# EAGLE design Keyboard (EAGLE 8.3.0)
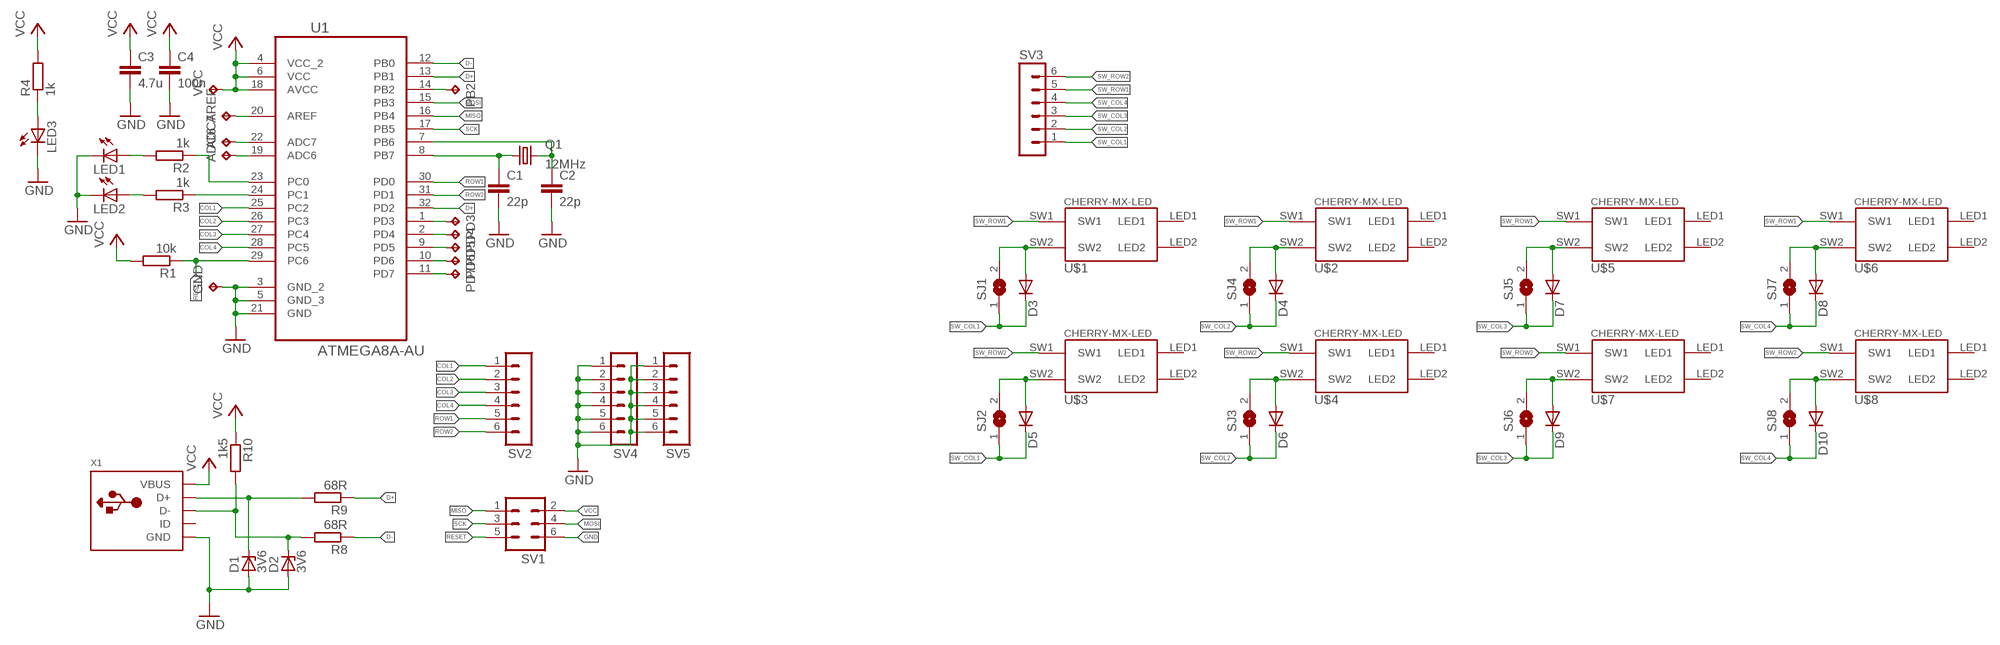
[diagram p0: schematic, sheet 1]

## Parts
ADC6  TPB1,27  [B1,27]
ADC7  TPB1,27  [B1,27]
AREF  TPB1,27  [B1,27]
C1  22p  C-EUC0603  [C0603]
C2  22p  C-EUC0603  [C0603]
C3  4.7u  C-EUC0603  [C0603]
C4  100n  C-EUC0603  [C0603]
D1  3V6  ZENER-DIODESOD80C  [SOD80C]
D2  3V6  ZENER-DIODESOD80C  [SOD80C]
D3  DIODE-MINIMELF  [MINIMELF]
D4  DIODE-MINIMELF  [MINIMELF]
D5  DIODE-MINIMELF  [MINIMELF]
D6  DIODE-MINIMELF  [MINIMELF]
D7  DIODE-MINIMELF  [MINIMELF]
D8  DIODE-MINIMELF  [MINIMELF]
D9  DIODE-MINIMELF  [MINIMELF]
D10  DIODE-MINIMELF  [MINIMELF]
GND  TPB1,27  [B1,27]
LED1  LEDCHIP-LED0603  [CHIP-LED0603]
LED2  LEDCHIP-LED0603  [CHIP-LED0603]
LED3  LEDCHIP-LED0603  [CHIP-LED0603]
PB2  TPB1,27  [B1,27]
PD3  TPB1,27  [B1,27]
PD4  TPB1,27  [B1,27]
PD5  TPB1,27  [B1,27]
PD6  TPB1,27  [B1,27]
PD7  TPB1,27  [B1,27]
Q1  12MHz  KX-K  [11.4X4.5]
R1  10k  R-EU_R0603  [R0603]
R2  1k  R-EU_R0603  [R0603]
R3  1k  R-EU_R0603  [R0603]
R4  1k  R-EU_R0603  [R0603]
R8  68R  R-EU_R0603  [R0603]
R9  68R  R-EU_R0603  [R0603]
R10  1k5  R-EU_R0603  [R0603]
SJ1  SJCLOSED  [SJC]
SJ2  SJCLOSED  [SJC]
SJ3  SJCLOSED  [SJC]
SJ4  SJCLOSED  [SJC]
SJ5  SJCLOSED  [SJC]
SJ6  SJCLOSED  [SJC]
SJ7  SJCLOSED  [SJC]
SJ8  SJCLOSED  [SJC]
SV1  MA03-2  [MA03-2]
SV2  MA06-1  [MA06-1]
SV3  MA06-1  [MA06-1]
SV4  MA06-1  [MA06-1]
SV5  MA06-1  [MA06-1]
U1  ATMEGA8A-AU  [QFP80P900X900X120-32N]
U$1  CHERRY-MX-LED  [CHERRY-MX-LED]
U$2  CHERRY-MX-LED  [CHERRY-MX-LED]
U$3  CHERRY-MX-LED  [CHERRY-MX-LED]
U$4  CHERRY-MX-LED  [CHERRY-MX-LED]
U$5  CHERRY-MX-LED  [CHERRY-MX-LED]
U$6  CHERRY-MX-LED  [CHERRY-MX-LED]
U$7  CHERRY-MX-LED  [CHERRY-MX-LED]
U$8  CHERRY-MX-LED  [CHERRY-MX-LED]
VCC  TPB1,27  [B1,27]
X1  USB_MICRO_20329_V2  [4UCONN_20329_V2]

## Nets
COL1: SV2.1 U1.25(PC2)
COL2: SV2.2 U1.26(PC3)
COL3: SV2.3 U1.27(PC4)
COL4: SV2.4 U1.28(PC5)
D+: R9.1 U1.13(PB1) U1.32(PD2)
D-: R8.1 U1.12(PB0)
GND: C1.2 C2.2 C3.2 C4.2 D1.A D2.A GND.TP LED1.C LED2.C LED3.C SV1.6 SV4.1 SV4.2 SV4.3 SV4.4 SV4.5 SV4.6 SV5.1 SV5.2 SV5.3 SV5.4 SV5.5 SV5.6 U1.3(GND_2) U1.5(GND_3) U1.21(GND) X1.BASE@1(GND) X1.BASE@2(GND) X1.GND X1.SPRT@1(GND) X1.SPRT@2(GND) X1.SPRT@3(GND) X1.SPRT@4(GND)
MISO: SV1.1 U1.16(PB4)
MOSI: SV1.4 U1.15(PB3)
N$1: C1.1 Q1.1 U1.8(PB7)
N$2: C2.1 Q1.2 U1.7(PB6)
N$3: LED3.A R4.1
N$4: R3.1 U1.24(PC1)
N$5: R2.1 U1.23(PC0)
N$6: LED1.A R2.2
N$7: LED2.A R3.2
N$9: D1.C R9.2 X1.D+
N$10: D2.C R8.2 R10.2 X1.D-
N$14: PD7.TP U1.11(PD7)
N$15: D3.A SJ1.2 U$1.SW2
N$16: D5.A SJ2.2 U$3.SW2
N$17: PD6.TP U1.10(PD6)
N$18: D4.A SJ4.2 U$2.SW2
N$19: PD5.TP U1.9(PD5)
N$20: D6.A SJ3.2 U$4.SW2
N$21: PD4.TP U1.2(PD4)
N$22: D7.A SJ5.2 U$5.SW2
N$23: PD3.TP U1.1(PD3)
N$24: D9.A SJ6.2 U$7.SW2
N$25: AREF.TP U1.20(AREF)
N$26: D8.A SJ7.2 U$6.SW2
N$27: ADC7.TP U1.22(ADC7)
N$28: D10.A SJ8.2 U$8.SW2
N$29: ADC6.TP U1.19(ADC6)
N$30: PB2.TP U1.14(PB2)
RESET: R1.1 SV1.5 U1.29(PC6)
ROW1: SV2.5 U1.30(PD0)
ROW2: SV2.6 U1.31(PD1)
SCK: SV1.3 U1.17(PB5)
SW_COL1: D3.C D5.C SJ1.1 SJ2.1 SV3.1
SW_COL2: D4.C D6.C SJ3.1 SJ4.1 SV3.2
SW_COL3: D7.C D9.C SJ5.1 SJ6.1 SV3.3
SW_COL4: D8.C D10.C SJ7.1 SJ8.1 SV3.4
SW_ROW1: SV3.5 U$1.SW1 U$2.SW1 U$5.SW1 U$6.SW1
SW_ROW2: SV3.6 U$3.SW1 U$4.SW1 U$7.SW1 U$8.SW1
VCC: C3.1 C4.1 R1.2 R4.2 R10.1 SV1.2 U1.4(VCC_2) U1.6(VCC) U1.18(AVCC) VCC.TP X1.VBUS
Unconnected: U$1.LED1 U$1.LED2 U$2.LED1 U$2.LED2 U$3.LED1 U$3.LED2 U$4.LED1 U$4.LED2 U$5.LED1 U$5.LED2 U$6.LED1 U$6.LED2 U$7.LED1 U$7.LED2 U$8.LED1 U$8.LED2 X1.ID

## Library data of the parts
ADC6 ADC7 AREF GND PB2 PD3-PD7 VCC = testpad:TP: Test pad
C1-C4 = resistor:C-EU: CAPACITOR, European symbol
D1 D2 = diode:ZENER-DIODE: Z-Diode
D3-D10 = diode:DIODE-: DIODE
LED1-LED3 = led:LED: LED OSRAM: - CHIPLED LG R971, LG N971, LY N971, LG Q971, LY Q971, LO R971, LY R971 LH N974, LH R974 LS Q976, LO Q976, LY Q976 LO Q996 - Hyper CHIPLED LW Q18S LB Q993, LB Q99A, LB R99A - SideLED LS A670, LO A670, LY A670, LG A670, LP A670 LB A673, LV A673, LT A673, LW A673 LH A674 LY A675 LS A676, LA A676, LO A676, LY A676, LW A676 LS A679, LY A679, LG A679 - Hyper Micro SIDELED® LS Y876, LA Y876, LO Y876, LY Y876 LT Y87S - SmartLED LW L88C, LW L88S LB L89C, LB L89S, LG L890 LS L89K, LO L89K, LY L89K LS L896, LA L896, LO L896, LY L896 - TOPLED LS T670, LO T670, LY T670, LG T670, LP T670 LSG T670, LSP T670, LSY T670, LOP T670, LYG T670 LG T671, LOG T671, LSG T671 LB T673, LV T673, LT T673, LW T673 LH T674 LS T676, LA T676, LO T676, LY T676, LB T676, LH T676, LSB T676, LW T676 LB T67C, LV T67C, LT T67C, LS T67K, LO T67K, LY T67K, LW E67C LS E67B, LA E67B, LO E67B, LY E67B, LB E67C, LV E67C, LT E67C LW T67C LS T679, LY T679, LG T679 LS T770, LO T770, LY T770, LG T770, LP T770 LB T773, LV T773, LT T773, LW T773 LH T774 LS E675, LA E675, LY E675, LS T675 LS T776, LA T776, LO T776, LY T776, LB T776 LHGB T686 LT T68C, LB T68C - Hyper Mini TOPLED® LB M676 - Mini TOPLED Santana® LG M470 LS M47K, LO M47K, LY M47K Source: http://www.osram.convergy.de LUXEON: - LUMILED® LXK2-PW12-R00, LXK2-PW12-S00, LXK2-PW14-U00, LXK2-PW14-V00 LXK2-PM12-R00, LXK2-PM12-S00, LXK2-PM14-U00 LXK2-PE12-Q00, LXK2-PE12-R00, LXK2-PE12-S00, LXK2-PE14-T00, LXK2-PE14-U00 LXK2-PB12-K00, LXK2-PB12-L00, LXK2-PB12-M00, LXK2-PB14-N00, LXK2-PB14-P00, LXK2-PB14-Q00 LXK2-PR12-L00, LXK2-PR12-M00, LXK2-PR14-Q00, LXK2-PR14-R00 LXK2-PD12-Q00, LXK2-PD12-R00, LXK2-PD12-S00 LXK2-PH12-R00, LXK2-PH12-S00 LXK2-PL12-P00, LXK2-PL12-Q00, LXK2-PL12-R00 Source: www.luxeon.com KINGBRIGHT: KA-3528ASYC Source: www.kingbright.com
Q1 = crystal-geyer_V1_0:KX: Quartz Crystals (MHz) SMD: KX - Serie Model Size l/w/h [mm] Frequency Range Frequency Stability Temp. Range [°C] Load Capacitance AECQ 200 availabel Datasheet KX-4 KX-5 KX-6 KX-7 KX-9A KX-9B KX-12A KX-12B KX-13 KX-20 KX-K KX-KS 1.6/1.2/0.3 2.0/1.6/0.45 2.5/2.0/0.55 3.2/2.5/0.8 5.0/3.2/1.0 5.0/3.2/1.1 6.0/3.5/1.1 6.0/3.5/1.0 7.0/5.0 /1.3 11.6/5.5/1.6 12.3/4.5/4.2 12.3/4.5/3.2 24.0 ~ 80.0 MHz 16.0 ~ 80.0 MHz 12.0 ~ 80.0 MHz 8.0 ~ 60.0 MHz 7,68 ~ 300,0 MHz 8,0 ~ 50,0 MHz 8,0 ~ 150,0 MHz 8,0 ~ 50,0 MHz 6,0 ~ 160,0 MHz 3,579 ~ 25,0 MHz 3,579 ~ 70,0 MHz 3,579 ~ 70,0 MHz ±10 … ±50ppm ±10 … ±50ppm ±10 … ±50ppm ±10 … ±50ppm ±10 … ±50ppm ±10 … ±50ppm ±10 … ±50ppm ±10 … ±50ppm ±10 … ±50ppm ±50ppm ±10 … ±50ppm ±10 … ±50ppm (*) -40°C …+85°C (*) -40°C …+125°C (*) -40°C …+125°C (*) -40°C …+125°C (*) -40°C …+105°C (*) -40°C …+105°C (*) -40°C …+125°C (*) -40°C …+105°C (*) -40°C …+105°C (*) -40°C …+105°C (*) -40°C …+85°C (*) -40°C …+85°C 8, 8…16 8, 8…16 10, 8…16 12, 7…20 16, 10…20 16, 10…20 16, 10…20 16, 12…20 16, 12…20 16, 12…20 16, 12…30 16, 12…30 - yes yes yes - - - - - - - - KX-4.pdf <http://www.geyer-electronic.de/uploads/tx_userartikelfrequenz/GEYER-KX-4.pdf> KX-5.pdf <http://www.geyer-electronic.de/uploads/tx_userartikelfrequenz/GEYER-KX-5.pdf> KX-6.pdf <http://www.geyer-electronic.de/uploads/tx_userartikelfrequenz/GEYER-KX-6.pdf> KX-7.pdf <http://www.geyer-electronic.de/uploads/tx_userartikelfrequenz/GEYER-KX-7.pdf> KX-9A.pdf <http://www.geyer-electronic.de/uploads/tx_userartikelfrequenz/GEYER-KX-9A.pdf> KX-9B.pdf <http://www.geyer-electronic.de/uploads/tx_userartikelfrequenz/GEYER-KX-9B.pdf> KX-12A.pdf <http://www.geyer-electronic.de/uploads/tx_userartikelfrequenz/GEYER-KX-12A.pdf> KX-12B.pdf <http://www.geyer-electronic.de/uploads/tx_userartikelfrequenz/GEYER-KX-12B.pdf> KX-13.pdf <http://www.geyer-electronic.de/uploads/tx_userartikelfrequenz/GEYER-KX-13.pdf> KX-20.pdf <http://www.geyer-electronic.de/uploads/tx_userartikelfrequenz/GEYER-KX-20.pdf> KX-K.pdf <http://www.geyer-electronic.de/uploads/tx_userartikelfrequenz/GEYER-KX-K.pdf> KX-KS.pdf <http://www.geyer-electronic.de/uploads/tx_userartikelfrequenz/GEYER-KX-KS.pdf> <http://www.geyer-electronic.de/fileadmin/template/img/logo-geyer-electronic.png> Details see: http://www.geyer-electronic.de/Frequenz-Produkte.9.0.html Created 2016-06-07, Hans Locher 2016 (C) Geyer Quartz Technology KX4,KX5,KX6,KX7,KX9A,KX9B,KX12A,KX12B,KX13,KX20,KXK,KXKS;1612;2016;2520;3225;5032;6035;7050;11655;12345;1,6x1,2;2,0x1,6;2,5x2,0;3,2x2,5;5,0x3,2;6,0x3,5;7,0x5,0;11,6x5,5;12,3x4,5;12,3x4,5;1.6x1.2;2.0x1.6;2.5x2.0;3.2x2.5;5.0x3.2;6.0x3.5;7.0x5.0;11.6x5.5;12.3x4.5;12.3x4.5;
R1-R4 R8-R10 = resistor:R-EU_: RESISTOR, European symbol
SJ1-SJ8 = jumper:SJ: SMD solder JUMPER
SV1 = con-lstb:MA03-2: PIN HEADER; OC_FARNELL: unknown; OC_NEWARK: unknown
SV2-SV5 = con-lstb:MA06-1: PIN HEADER; OC_FARNELL: unknown; OC_NEWARK: unknown
U1 = Atmel_By_element14_Batch_1-00:ATMEGA8A-AU: Programmable Flash; MPN: ATMEGA8A-AU; OC_FARNELL: 1748532; OC_NEWARK: 26R5638; PACKAGE: TQFP-32; SUPPLIER: Atmel
U$1-U$8 = cherrymx:CHERRY-MX-LED: Cherry MX series keyswitch with LED
X1 = microbuilder:USB: USB Connectors USBMINIB - Surface Mount Female Mini-B USB Connector 4UConnector: 06564

## Board
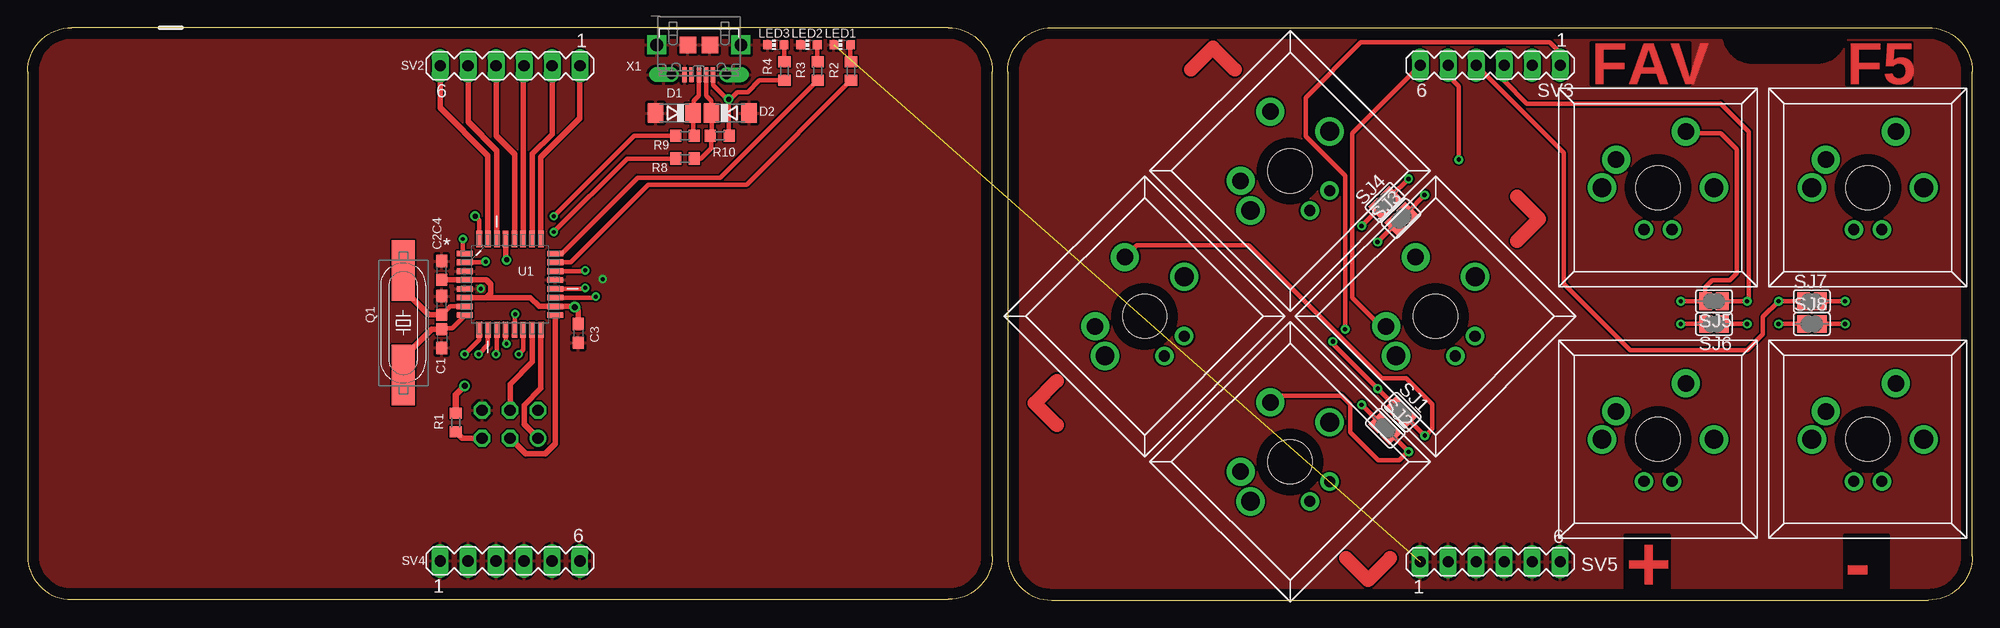
[diagram p1: board, top side]
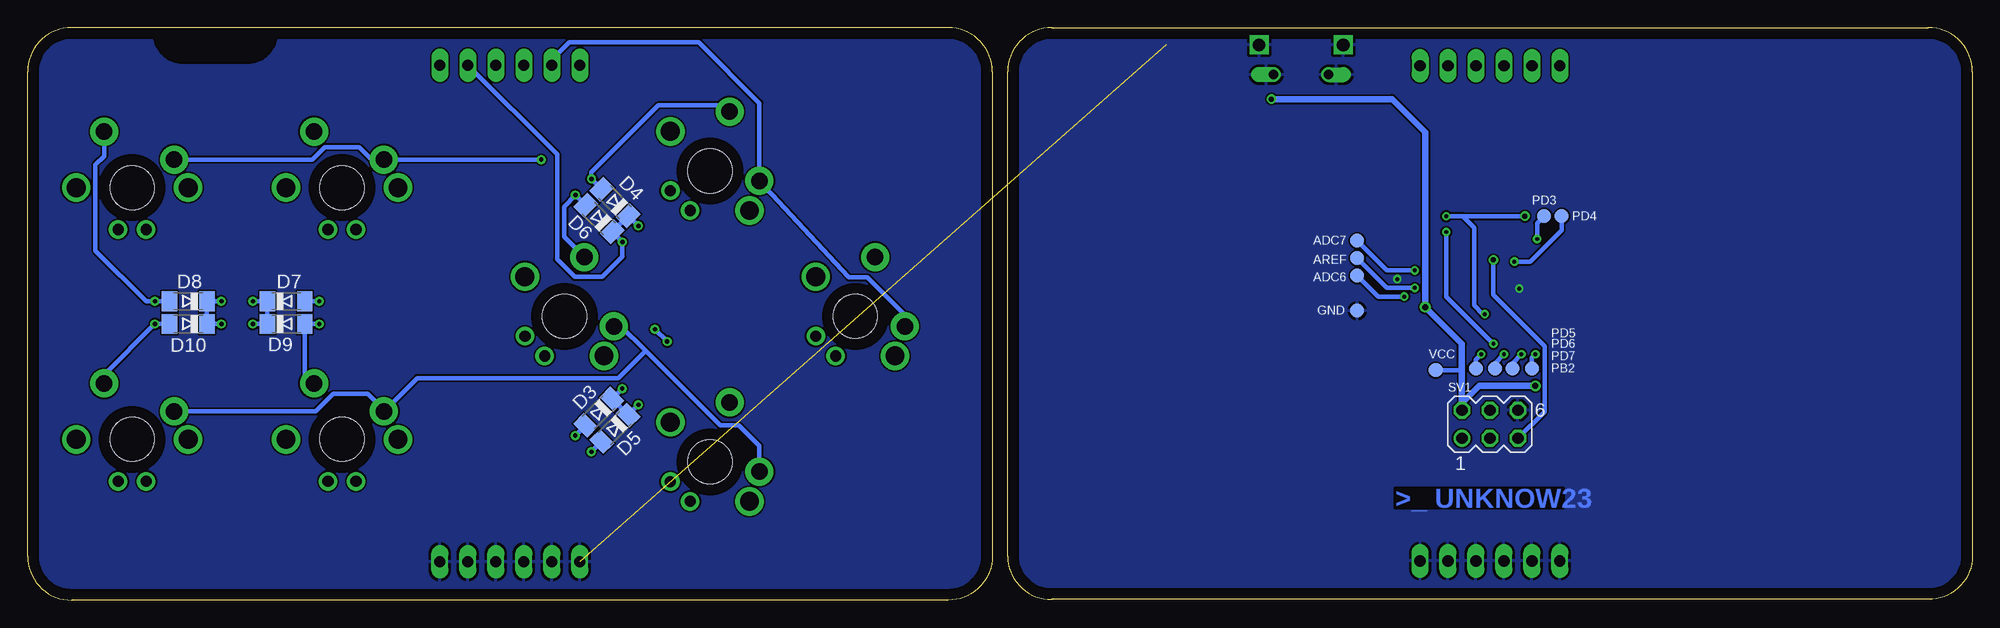
[diagram p2: board, bottom side, seen from below]

Size 176.61 x 52 mm. Coordinates in mm from the lower left corner, seen from the top.
Outline: 93,0 172.61,0 arc90 176.61,4 176.61,48 arc90 172.61,52 93,52 arc90 89,48 89,4 arc90 93,0
Outline: 87.61,4 87.61,48 arc90 83.61,52 4,52 arc90 0,48 0,4 arc90 4,0.07 83.61,0.07 arc90 87.61,4
Copper layers (1*16): Top 0.035mm / dielectric 1.5mm / Bottom 0.035mm
Design rules "default *": minimum track width 6mil, minimum drill 0.35mm, track to track 6mil, track to pad 6mil, pad to pad 6mil, via to via 6mil, smd to smd 6mil, copper to edge 40mil, drill to drill 6mil, minimum pad ring 10mil, minimum via ring 8mil, stop-mask expansion 4mil, vias tented up to drill 0mil, thermal gap 10mil
tRestrict: area 154.1,48.9 to 165,51.9
bRestrict: area 154.1,48.9 to 165,51.9

### Footprints (pad centres in the part's own frame; a part is rotated, then mirrored left to right if it is on the bottom)
B1,27 = smd 1.27 x 1.27: TP 0,0
C0603 = smd 1.1 x 1: 1 -0.85,0; 2 0.85,0
SOD80C = smd 1.4 x 1.8: A 1.7,0; C -1.7,0
MINIMELF = smd 1.4 x 1.8: A 1.7,0; C -1.7,0
CHIP-LED0603 = smd 0.8 x 0.8: A 0,-0.75; C 0,0.75
11.4X4.5 = smd 5.5 x 2.08: 1 -4.75,0; 2 4.75,0
R0603 = smd 1 x 1.1: 1 -0.85,0; 2 0.85,0
SJC = smd 1.168 x 1.6: 1 -0.762,0; 2 0.762,0
MA03-2 = drill 1.016: 1 -2.54,-1.27 | drill 1.016 octagon: 2 -2.54,1.27; 3 0,-1.27; 4 0,1.27; 5 2.54,-1.27; 6 2.54,1.27
MA06-1 = drill 1.016 long: 1 -6.35,0; 2 -3.81,0; 3 -1.27,0; 4 1.27,0; 5 3.81,0; 6 6.35,0
QFP80P900X900X120-32N = smd 1.473 x 0.508: 1 -4.115,2.794; 2 -4.115,2.007; 3 -4.115,1.194; 4 -4.115,0.406; 5 -4.115,-0.406; 6 -4.115,-1.194; 7 -4.115,-2.007; 8 -4.115,-2.794; 17 4.115,-2.794; 18 4.115,-2.007; 19 4.115,-1.194; 20 4.115,-0.406; 21 4.115,0.406; 22 4.115,1.194; 23 4.115,2.007; 24 4.115,2.794 | smd 0.508 x 1.473: 9 -2.794,-4.115; 10 -2.007,-4.115; 11 -1.194,-4.115; 12 -0.406,-4.115; 13 0.406,-4.115; 14 1.194,-4.115; 15 2.007,-4.115; 16 2.794,-4.115; 25 2.794,4.115; 26 2.007,4.115; 27 1.194,4.115; 28 0.406,4.115; 29 -0.406,4.115; 30 -1.194,4.115; 31 -2.007,4.115; 32 -2.794,4.115
CHERRY-MX-LED = drill 1.016 pad 1.676: LED1 -1.27,-3.81; LED2 1.27,-3.81 | drill 1.714 pad 1.93: P$3 -5.08,0; P$4 5.08,0 | drill 1.5 pad 2.54: SW1 -3.81,2.54; SW2 2.54,5.08 | hole 4: 0,0
4UCONN_20329_V2 = smd 1.5 x 1.5: BASE@1 -1,0; BASE@2 1,0 | smd 0.4 x 1.35: D+ 0,2.7; D- -0.65,2.7; GND 1.3,2.7; ID 0.65,2.7; VBUS -1.3,2.7 | drill 0.85 pad 1.2 offset: SPRT@1 -2.5,2.7; SPRT@2 2.5,2.7 | drill 1.15 pad 1.55 square: SPRT@3 -3.825,0; SPRT@4 3.825,0

### Placement (x,y rotation side)
ADC6  55.88,29.47 0 bottom
ADC7  55.88,32.65 0 bottom
AREF  55.88,31.06 0 bottom
C1  37.62,23.75 270 top
C2  37.62,26.77 90 top
C3  50.01,24.23 270 top
C4  37.62,29.95 90 top
D1  58.74,44.23 180 top
D2  63.82,44.23 0 top
D3  124.74,17.07 225 bottom
D4  123.27,36.12 135 bottom
D5  123.28,15.61 225 bottom
D6  124.73,34.66 135 bottom
D7  153.13,27.15 0 bottom
D8  162.03,27.15 180 bottom
D9  153.13,25.08 0 bottom
D10  162.03,25.08 180 bottom
GND  55.88,26.3 0 bottom
LED1  73.98,50.42 90 top
LED2  70.96,50.42 90 top
LED3  67.94,50.42 90 top
PB2  45.09,21.06 0 bottom
PD3  38.89,34.87 0 bottom
PD4  37.31,34.87 0 bottom
PD5  40.01,21.06 0 bottom
PD6  41.75,21.06 0 bottom
PD7  43.34,21.06 0 bottom
Q1  34.13,25.18 90 top
R1  38.89,16.14 90 top
R2  74.77,48.04 90 top
R3  71.75,48.04 90 top
R4  68.74,48.04 270 top
R8  59.69,40.11 0 top
R9  59.69,42.17 0 top
R10  62.87,42.17 180 top
SJ1  124.74,17.07 315 top
SJ2  123.28,15.61 315 top
SJ3  124.73,34.66 45 top
SJ4  123.27,36.12 45 top
SJ5  153.13,27.15 180 top
SJ6  153.13,25.08 180 top
SJ7  162.03,27.15 0 top
SJ8  162.03,25.08 0 top
SV1  43.81,15.98 0 bottom
SV2  43.81,48.52 180 top
SV3  132.81,48.58 180 top
SV4  43.81,3.56 0 top
SV5  132.81,3.49 0 top
U1  43.81,28.68 0 top
U$1  101.44,25.77 45 top
U$2  114.64,38.98 45 top
U$3  114.64,12.56 45 top
U$4  127.85,25.77 45 top
U$5  148.06,37.47 0 top
U$6  167.1,37.47 0 top
U$7  148.06,14.61 0 top
U$8  167.1,14.61 0 top
VCC  48.74,20.9 0 bottom
X1  60.96,50.42 180 top

### Tracks (layer width: path | path; a pad name or v marks a point on that pad's centre or on a via)
COL1
  Top 0.508: U1.25 46.61,40.2 50.16,43.76 SV2.1
COL2
  Top 0.508: U1.26 45.82,40.52 47.62,42.33 SV2.2
COL3
  Top 0.508: U1.27 45.01,48.44 SV2.3
COL4
  Top 0.508: U1.28 44.22,40.49 42.55,42.17 SV2.4
D+  (via drill 0.35, 0.45)
  Top 0.406: R9.1 55.09,42.17 v47.78,34.87 | 41.02,33.06 41.02,34.49 v40.64,34.87 | U1.13 44.22,25.75 v44.29,25.98
  Top 0.508: U1.32 41.02,33.06
  Bottom 0.406: 46.28,34.87 v47.78,34.87 | 46.28,34.87 v40.64,34.87 | 46.28,34.87 45.24,33.83 45.24,26.77 44.45,25.98 v44.29,25.98
D-  (via drill 0.35)
  Top 0.406: U1.12 43.41,23.37 v43.5,23.28 | R8.1 54.45,40.11 v47.78,33.44
  Bottom 0.406: v47.78,33.44 47.78,27.57 v43.5,23.28
GND  (via drill 0.35)  (1 unrouted)
  other vias: 41.15,28.29 52.23,29.15
  pour Top: 0,-1 176.63,-1 176.63,52.33 0,52.33
  pour Bottom: 0,-1 176.63,-1 176.63,52.33 0,52.33
MISO
  Top 0.508: U1.16 46.61,19.25 45.09,17.72 45.09,15.98 SV1.1
MOSI
  Top 0.508: SV1.4 43.81,19.63 45.82,21.63 U1.15
N$1
  Top 0.406: U1.8 39.7,25.83 38.58,24.71 37.73,24.71 C1.1
  Top 0.508: C1.1 36.73,24.61 34.45,22.33 34.45,20.75 Q1.1
N$2
  Top 0.406: U1.7 38.37,26.67 C2.1
  Top 0.508: C2.1 36.41,25.92 34.61,27.72 34.61,29.46 Q1.2
N$3
  Top 0.406: LED3.A 68.69,48.94 R4.1
N$4
  Top 0.406: U1.24 48.51,31.47 55.4,38.36 62.92,38.36 R3.1
N$5
  Top 0.406: U1.23 49.31,30.68 56.36,37.73 65.3,37.73 R2.1
N$6
  Top 0.406: LED1.A 74.73,48.94 R2.2
N$7
  Top 0.406: LED2.A 71.71,48.94 R3.2
N$8
  Top 1.27: 93.46,19.91 91.46,17.91 93.46,15.91
N$9
  Top 0.406: X1.D+ 60.96,45.82 60.48,45.34 60.48,44.28 D1.C 60.44,42.27 R9.2
N$10
  Top 0.406: X1.D- 61.61,45.81 62.07,45.34 62.07,44.28 D2.C 62.12,42.27 R10.2 62.07,42.11 62.07,41.06 61.12,40.11 R8.2
N$11
  Top 1.27: 109.64,48.17 107.64,50.17 105.64,48.17
N$12
  Top 1.27: 135.27,36.63 137.27,34.63 135.27,32.63
N$13
  Top 1.27: 119.73,3.83 121.73,1.83 123.73,3.83
N$14  (via drill 0.35)
  Top 0.406: U1.11 42.62,22.4 v42.55,22.33
  Bottom 0.406: PD7.TP 43.34,21.53 v42.55,22.33
N$15  (via drill 0.4)
  Top 0.406: SJ1.2 v126.87,14.94 126.96,14.94 127.58,15.56 127.58,17.78 125.19,20.16 122.97,20.16 110.91,32.23 100.71,32.23 U$1.SW2
  Bottom 0.406: D3.A v126.87,14.94
N$16  (via drill 0.4)
  Top 0.406: SJ2.2 v125.41,13.48 125.34,13.48 124.56,12.7 122.66,12.7 120.11,15.24 120.11,17.78 119.32,18.57 113.47,18.57 U$3.SW2
  Bottom 0.406: v125.41,13.48 D5.A
N$17  (via drill 0.35)
  Top 0.406: U1.10 41.81,23.18 v40.96,22.33
  Bottom 0.406: PD6.TP 41.75,21.53 v40.96,22.33
N$18  (via drill 0.4)
  Top 0.406: v125.4,38.25 SJ4.2
  Bottom 0.406: D4.A v125.4,38.25 125.4,38.84 119.32,44.93 114.04,44.93 U$2.SW2
N$19  (via drill 0.35)
  Top 0.406: U1.9 41.02,23.66 v39.69,22.33
  Bottom 0.406: PD5.TP 40.01,22.01 v39.69,22.33
N$20  (via drill 0.4)
  Top 0.406: SJ3.2 v126.86,36.8
  Bottom 0.406: D6.A v126.86,36.8 126.86,36.75 127.89,35.72 127.89,33 U$4.SW2
N$21  (via drill 0.35)
  Top 0.406: v41.59,30.74 41.53,30.68 U1.2
  Bottom 0.406: v41.59,30.74 40.16,30.74 37.31,33.6 PD4.TP
N$22  (via drill 0.4)
  Top 0.406: U$5.SW2 150.75,42.39 153.77,42.39 155.2,40.96 155.2,29.69 154.56,29.05 152.98,29.05 152.34,28.42 152.34,27.18 | 150.12,27.18 150.15,27.15 v150.12,27.15 152.31,27.15 152.34,27.18 | 152.34,27.18 SJ5.2
  Bottom 0.406: D7.A v150.12,27.15
N$23  (via drill 0.35)
  Top 0.406: U1.1 39.53,31.64 v39.53,32.8
  Bottom 0.406: PD3.TP 39.53,34.23 v39.53,32.8
N$24  (via drill 0.4)
  Top 0.406: SJ6.2 v150.12,25.08
  Bottom 0.406: v150.12,25.08 D9.A | 151.23,24.88 D9.A | D9.A 151.44,20.52 U$7.SW2
N$25  (via drill 0.35)
  Top 0.406: U1.20 50.55,28.27 v50.64,28.36
  Bottom 0.406: AREF.TP 53.18,28.36 v50.64,28.36
N$26  (via drill 0.4)
  Top 0.406: SJ7.2 v165.04,27.15
  Bottom 0.406: D8.A v165.04,27.15 165.84,27.15 170.44,31.75 170.44,39.53 169.65,40.32 U$6.SW2
N$27  (via drill 0.35)
  Top 0.406: U1.22 50.56,29.87 v50.64,29.95
  Bottom 0.406: ADC7.TP 53.18,29.95 v50.64,29.95
N$28  (via drill 0.4)
  Top 0.406: SJ8.2 v165.04,25.08
  Bottom 0.406: D10.A v165.04,25.08 169.65,20.48 U$8.SW2
N$29  (via drill 0.35)
  Top 0.406: U1.19 51.51,27.48 v51.59,27.57
  Bottom 0.406: ADC6.TP 53.98,27.57 v51.59,27.57
N$30  (via drill 0.35)
  Top 0.406: U1.14 45.01,22.73 v44.61,22.33
  Bottom 0.406: PB2.TP 45.09,21.85 v44.61,22.33
RESET  (via drill 0.45)
  Top 0.508: U1.29 43.41,30.99 v43.5,30.9 | SV1.5 39.47,14.71 R1.1
  Bottom 0.406: v43.5,30.9 43.5,27.72 38.85,23.08 38.85,17.13 SV1.5
ROW1
  Top 0.508: U1.30 42.62,40.82 40.01,43.44 SV2.5
ROW2
  Top 0.508: U1.31 41.81,40.37 37.47,44.71 SV2.6
SCK
  Top 0.508: U1.17 47.93,14.22 46.99,13.28 45.24,13.28 SV1.3
SW_COL1  (via drill 0.4)
  Top 0.406: SJ2.1 v121.15,17.75 | SJ1.1 v122.61,19.2 118.53,23.28 v118.53,23.5 | SV3.1 139.16,49.69 138.21,50.64 121.07,50.64 116.05,45.62 116.05,42.13 119.64,38.54 v119.64,24.61
  Bottom 0.406: v121.15,17.75 D5.C D3.C v122.61,19.2 | v118.53,23.5 v119.64,24.61
SW_COL2  (via drill 0.4)
  Top 0.406: SJ3.1 v122.6,32.53 | SJ4.1 v121.14,33.99
  Bottom 0.406: v121.14,33.99 D4.C D6.C v122.6,32.53 122.6,31.17 124.4,29.37 126.94,29.37 128.53,30.96 128.53,40.48 SV3.2
SW_COL3  (via drill 0.4)
  Top 0.406: SJ6.1 v156.15,25.08 | SV3.3 134.09,47.15 136.15,45.09 153.77,45.09 156.31,42.55 156.31,27.3 v156.15,27.15 SJ5.1
  Bottom 0.406: v156.15,27.15 D7.C D9.C v156.15,25.08
SW_COL4  (via drill 0.4)
  Top 0.406: SJ8.1 v159.01,25.08 | SJ7.1 v159.01,27.15 157.58,25.72 157.58,24.13 156.15,22.7 145.51,22.7 139.48,28.73 139.48,40.64 SV3.4
  Bottom 0.406: v159.01,25.08 D10.C D8.C v159.01,27.15 | 131.54,48.1 SV3.4
SW_ROW1  (via drill 0.4)
  Top 0.406: SV3.5 129,47.62 129.96,46.67 v129.96,40.01
  Bottom 0.406: SV3.5 129,49.05 127.42,50.64 115.67,50.64 110.15,45.12 U$2.SW1 102.08,29.37 102.01,29.31 100.37,29.31 96.79,25.73 96.79,25.03 U$1.SW1 | v129.96,40.01 U$5.SW1 145.36,40.01 146.47,41.12 149.64,41.12 150.75,40.01 U$6.SW1
SW_ROW2
  Top 0.406: SV3.6 120.27,42.39 120.27,27.46 122.73,25.01 123.22,25.01 U$4.SW1
  Bottom 0.406: 120.58,22.73 120.58,22.55 122.97,20.16 141.23,20.16 144.18,17.21 | 144.18,17.21 U$7.SW1 | U$8.SW1 150.44,17.14 148.85,18.73 145.71,18.73 144.18,17.21 | U$4.SW1 122.73,24.87 120.58,22.73 | U$3.SW1 110.15,14.01 112.02,15.88 113.73,15.88 120.58,22.73
VCC  (via drill 0.45, 0.55)
  Top 0.406: X1.VBUS 62.26,46.74 63.66,45.34 | 63.66,45.34 63.66,42.23 R10.1 | R4.2 66.46,47.19 65.41,46.14 64.45,46.14 63.66,45.34 | v63.66,45.5 63.66,45.34
  Top 0.508: C4.1 37.64,29.08 U1.4 41.66,29.08 42.07,28.68 42.07,27.88 41.67,27.48 | U1.6 41.67,27.48 | v49.69,26.61 49.63,26.67 U1.18 46.46,26.67 45.64,27.48 41.67,27.48 | 49.85,26.77 v49.69,26.61 | C3.1 50.01,26.3 v49.69,26.61
  Top 0.61: R1.2 38.89,18.68 v39.69,19.47
  Bottom 0.406: VCC.TP 46.36,20.9 46.35,20.9
  Bottom 0.61: v39.69,19.47 44.77,19.47 46.35,17.88 SV1.2 46.35,20.9 46.35,23.28 v49.69,26.61 49.69,42.49 52.7,45.5 v63.66,45.5

### Text on the board
Top: FAV | F5 | + | -
Bottom: >_ UNKNOW23
tStop: FAV | F5 | + | -
bStop: >_ UNKNOW23